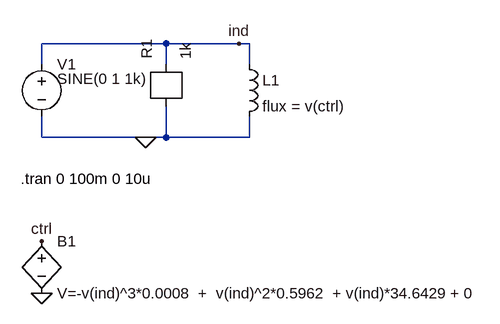
[diagram p0: schematic inductor.asc]
inductor.asc, the LTspice schematic file:
Version 4
SHEET 1 1256 680
WIRE 320 176 128 176
WIRE 432 176 320 176
WIRE 448 176 432 176
WIRE 128 208 128 176
WIRE 320 208 320 176
WIRE 448 208 448 176
WIRE 128 320 128 288
WIRE 288 320 128 320
WIRE 320 320 320 272
WIRE 320 320 288 320
WIRE 448 320 448 288
WIRE 448 320 320 320
FLAG 288 320 0
FLAG 128 480 ctrl
FLAG 128 560 0
FLAG 432 176 ind
SYMBOL ind 432 192 R0
SYMATTR InstName L1
SYMATTR Value flux = v(ctrl)
SYMBOL voltage 128 192 R0
WINDOW 3 24 38 Left 2
SYMATTR InstName V1
SYMATTR Value SINE(0 1 1k)
SYMATTR Value2 AC 1
SYMATTR SpiceLine Rser=1
SYMBOL r 320 272 R270
SYMATTR InstName R1
SYMATTR Value 1k
SYMBOL bv 128 464 R0
SYMATTR InstName B1
SYMATTR Value V=-v(ind)^3*0.0008  +  v(ind)^2*0.5962  + v(ind)*34.6429 + 0
TEXT 96 384 Left 2 !.tran 0 100m 0 10u

The netlist it stands for:
* inductor.asc
L1 ind 0 flux = v(ctrl)
V1 ind 0 SINE(0 1 1k) AC 1 Rser=1
R1 ind 0 1k
B1 ctrl 0 V=-v(ind)^3*0.0008  +  v(ind)^2*0.5962  + v(ind)*34.6429 + 0
.tran 0 100m 0 10u
.backanno
.end